# EAGLE schematic main (EAGLE 8.6.3)
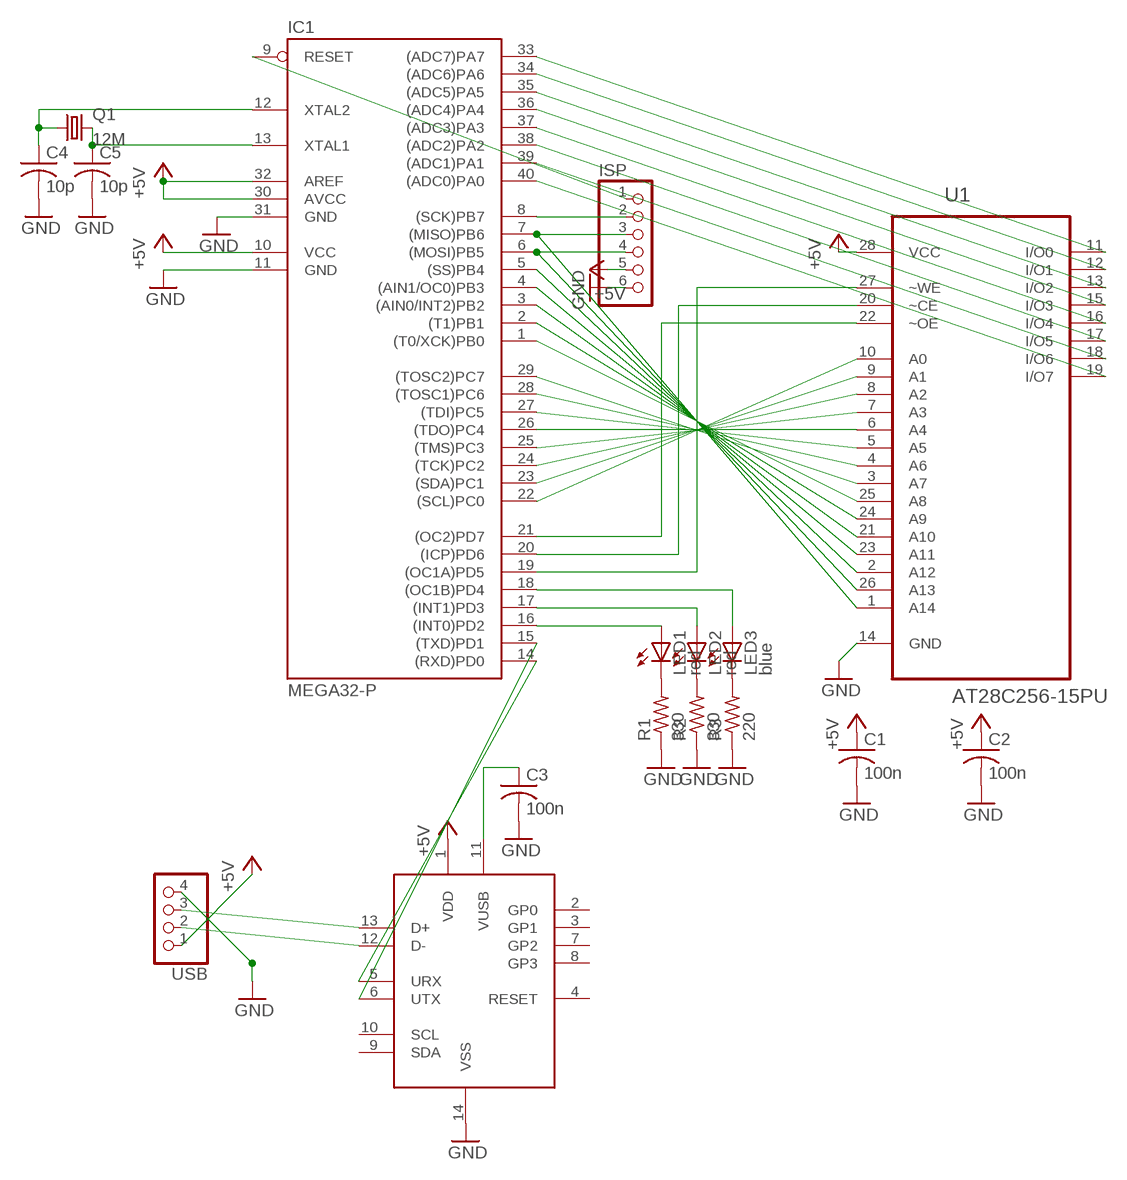
[diagram p0: schematic, sheet 1]

## Parts
BR1  MCP2221A  [DIP14]
C1  100n  C-USC0603  [C0603]
C2  100n  C-USC0603  [C0603]
C3  100n  C-USC0603  [C0603]
C4  10p  C-USC0603  [C0603]
C5  10p  C-USC0603  [C0603]
IC1  MEGA32-P  [DIL40]
ISP  PINHD-1X6  [1X06]
LED1  red  LED5MM  [LED5MM]
LED2  red  LED5MM  [LED5MM]
LED3  blue  LED5MM  [LED5MM]
Q1  12M  CRYSTALHC49S  [HC49/S]
R1  330  R-US_R0805  [R0805]
R2  330  R-US_R0805  [R0805]
R3  220  R-US_R0805  [R0805]
U1  AT28C256-15PU  [DIP254P1524X482-28]
USB  PINHD-1X4  [1X04]

## Nets
+5V: BR1.1(VDD) C1.1 C2.1 IC1.10(VCC) IC1.30(AVCC) IC1.32(AREF) ISP.5 U1.28(VCC) USB.1
GND: BR1.14(VSS) C1.2 C2.2 C3.2 C4.2 C5.2 IC1.11(GND) IC1.31(GND) ISP.6 R1.1 R2.1 R3.1 U1.14(GND) USB.4
N$1: LED1.K(C) R1.2
N$2: IC1.33((ADC7)PA7) U1.11(I/O0)
N$3: IC1.34((ADC6)PA6) U1.12(I/O1)
N$4: IC1.35((ADC5)PA5) U1.13(I/O2)
N$5: IC1.36((ADC4)PA4) U1.15(I/O3)
N$6: IC1.37((ADC3)PA3) U1.16(I/O4)
N$7: IC1.38((ADC2)PA2) U1.17(I/O5)
N$8: IC1.39((ADC1)PA1) U1.18(I/O6)
N$9: IC1.40((ADC0)PA0) U1.19(I/O7)
N$10: LED2.K(C) R2.2
N$11: IC1.16((INT0)PD2) LED1.A
N$12: IC1.17((INT1)PD3) LED2.A
N$13: IC1.21((OC2)PD7) U1.22(~OE)
N$14: IC1.20((ICP)PD6) U1.20(~CE)
N$15: IC1.19((OC1A)PD5) U1.27(~WE)
N$16: LED3.K(C) R3.2
N$17: IC1.18((OC1B)PD4) LED3.A
N$18: BR1.11(VUSB) C3.1
N$19: IC1.8((SCK)PB7) ISP.2
N$20: IC1.7((MISO)PB6) ISP.3 U1.1(A14)
N$21: IC1.6((MOSI)PB5) ISP.4 U1.26(A13)
N$22: IC1.9(RESET) ISP.1
N$23: C4.1 IC1.12(XTAL2) Q1.1
N$24: C5.1 IC1.13(XTAL1) Q1.2
N$25: IC1.22((SCL)PC0) U1.10(A0)
N$26: IC1.23((SDA)PC1) U1.9(A1)
N$27: IC1.24((TCK)PC2) U1.8(A2)
N$28: IC1.25((TMS)PC3) U1.7(A3)
N$29: IC1.26((TDO)PC4) U1.6(A4)
N$30: IC1.27((TDI)PC5) U1.5(A5)
N$31: IC1.28((TOSC1)PC6) U1.4(A6)
N$32: IC1.29((TOSC2)PC7) U1.3(A7)
N$33: IC1.1((T0/XCK)PB0) U1.25(A8)
N$34: IC1.2((T1)PB1) U1.24(A9)
N$35: IC1.3((AIN0/INT2)PB2) U1.21(A10)
N$36: IC1.4((AIN1/OC0)PB3) U1.23(A11)
N$37: IC1.5((SS)PB4) U1.2(A12)
N$38: BR1.13(D+) USB.3
N$39: BR1.12(D-) USB.2
N$40: BR1.5(URX) IC1.14((RXD)PD0)
N$41: BR1.6(UTX) IC1.15((TXD)PD1)
Unconnected: BR1.2(GP0) BR1.3(GP1) BR1.4(RESET) BR1.7(GP2) BR1.8(GP3) BR1.9(SDA) BR1.10(SCL)

## Library data of the parts
BR1 = 7_segment_lib:MCP2221A
C1-C5 = rcl:C-US: CAPACITOR, American symbol; SPICEPREFIX: C
IC1 = 7_segment_lib:MEGA32-P: MICROCONTROLLER 32 Kbytes FLASH 2 Kbytes SRAM 1 Kbytes EEPROM USART 8-channel 10 bit ADC Source: www.atmel.com .. doc2503.pdf; MPN: ATMEGA32-16PU; OC_FARNELL: 1661729; OC_NEWARK: 51P1794
ISP = pinhead:PINHD-1X6: PIN HEADER
LED1-LED3 = led:LED: LED OSRAM: - CHIPLED LG R971, LG N971, LY N971, LG Q971, LY Q971, LO R971, LY R971 LH N974, LH R974 LS Q976, LO Q976, LY Q976 LO Q996 - Hyper CHIPLED LW Q18S LB Q993, LB Q99A, LB R99A - SideLED LS A670, LO A670, LY A670, LG A670, LP A670 LB A673, LV A673, LT A673, LW A673 LH A674 LY A675 LS A676, LA A676, LO A676, LY A676, LW A676 LS A679, LY A679, LG A679 - Hyper Micro SIDELED® LS Y876, LA Y876, LO Y876, LY Y876 LT Y87S - SmartLED LW L88C, LW L88S LB L89C, LB L89S, LG L890 LS L89K, LO L89K, LY L89K LS L896, LA L896, LO L896, LY L896 - TOPLED LS T670, LO T670, LY T670, LG T670, LP T670 LSG T670, LSP T670, LSY T670, LOP T670, LYG T670 LG T671, LOG T671, LSG T671 LB T673, LV T673, LT T673, LW T673 LH T674 LS T676, LA T676, LO T676, LY T676, LB T676, LH T676, LSB T676, LW T676 LB T67C, LV T67C, LT T67C, LS T67K, LO T67K, LY T67K, LW E67C LS E67B, LA E67B, LO E67B, LY E67B, LB E67C, LV E67C, LT E67C LW T67C LS T679, LY T679, LG T679 LS T770, LO T770, LY T770, LG T770, LP T770 LB T773, LV T773, LT T773, LW T773 LH T774 LS E675, LA E675, LY E675, LS T675 LS T776, LA T776, LO T776, LY T776, LB T776 LHGB T686 LT T68C, LB T68C - Hyper Mini TOPLED® LB M676 - Mini TOPLED Santana® LG M470 LS M47K, LO M47K, LY M47K Source: http://www.osram.convergy.de LUXEON: - LUMILED® LXK2-PW12-R00, LXK2-PW12-S00, LXK2-PW14-U00, LXK2-PW14-V00 LXK2-PM12-R00, LXK2-PM12-S00, LXK2-PM14-U00 LXK2-PE12-Q00, LXK2-PE12-R00, LXK2-PE12-S00, LXK2-PE14-T00, LXK2-PE14-U00 LXK2-PB12-K00, LXK2-PB12-L00, LXK2-PB12-M00, LXK2-PB14-N00, LXK2-PB14-P00, LXK2-PB14-Q00 LXK2-PR12-L00, LXK2-PR12-M00, LXK2-PR14-Q00, LXK2-PR14-R00 LXK2-PD12-Q00, LXK2-PD12-R00, LXK2-PD12-S00 LXK2-PH12-R00, LXK2-PH12-S00 LXK2-PL12-P00, LXK2-PL12-Q00, LXK2-PL12-R00 Source: www.luxeon.com KINGBRIGHT: KA-3528ASYC Source: www.kingbright.com
Q1 = crystal:CRYSTAL: CRYSTAL; OC_FARNELL: 1667008; OC_NEWARK: unknown
R1-R3 = rcl:R-US_: RESISTOR, American symbol; SPICEPREFIX: R
U1 = 7_segment_lib:AT28C256-15PU: Paged Parallel EEPROM; DESCRIPTION: Paged Parallel EEPROM; MPN: AT28C256-15PU; OC_FARNELL: 1095782; OC_NEWARK: 96K6555; PACKAGE: PDIP-28; SUPPLIER: ATMEL
USB = pinhead:PINHD-1X4: PIN HEADER